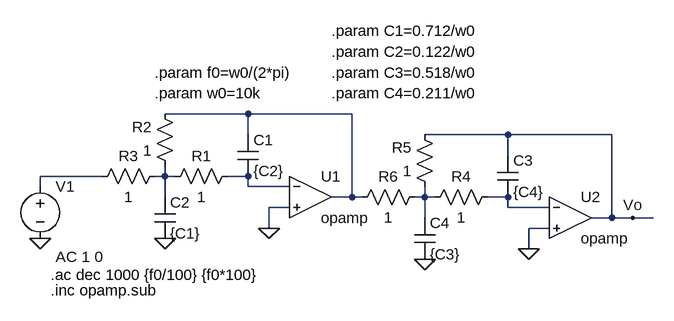
[diagram p0: schematic EJ6.asc]
EJ6.asc, the LTspice schematic file:
Version 4
SHEET 1 880 680
WIRE 112 48 -16 48
WIRE 272 48 112 48
WIRE 112 80 112 48
WIRE 512 80 384 80
WIRE 672 80 512 80
WIRE 512 112 512 80
WIRE -112 144 -208 144
WIRE -16 144 -16 128
WIRE -16 144 -32 144
WIRE 0 144 -16 144
WIRE 112 144 80 144
WIRE -208 160 -208 144
WIRE 112 160 112 144
WIRE 176 160 112 160
WIRE -16 176 -16 144
WIRE 272 176 272 48
WIRE 272 176 240 176
WIRE 288 176 272 176
WIRE 384 176 384 160
WIRE 384 176 368 176
WIRE 400 176 384 176
WIRE 512 176 480 176
WIRE 176 192 144 192
WIRE 512 192 512 176
WIRE 576 192 512 192
WIRE 384 208 384 176
WIRE 672 208 672 80
WIRE 672 208 640 208
WIRE 704 208 672 208
WIRE 736 208 704 208
WIRE 144 224 144 192
WIRE 576 224 544 224
WIRE 544 256 544 224
FLAG 144 224 0
FLAG -16 240 0
FLAG -208 240 0
FLAG 544 256 0
FLAG 384 272 0
FLAG 704 208 Vo
SYMBOL Opamps\\opamp 208 112 R0
SYMATTR InstName U1
SYMBOL cap 96 80 R0
SYMATTR InstName C1
SYMATTR Value {C2}
SYMBOL res 96 128 R90
WINDOW 0 0 56 VBottom 2
WINDOW 3 32 56 VTop 2
SYMATTR InstName R1
SYMATTR Value 1
SYMBOL res 0 144 R180
WINDOW 0 36 76 Left 2
WINDOW 3 36 40 Left 2
SYMATTR InstName R2
SYMATTR Value 1
SYMBOL res -128 160 R270
WINDOW 0 32 56 VTop 2
WINDOW 3 0 56 VBottom 2
SYMATTR InstName R3
SYMATTR Value 1
SYMBOL cap -32 176 R0
SYMATTR InstName C2
SYMATTR Value {C1}
SYMBOL voltage -208 144 R0
WINDOW 123 24 124 Left 2
WINDOW 39 0 0 Left 0
SYMATTR Value2 AC 1 0
SYMATTR InstName V1
SYMATTR Value ""
SYMBOL Opamps\\opamp 608 144 R0
SYMATTR InstName U2
SYMBOL cap 496 112 R0
SYMATTR InstName C3
SYMATTR Value {C4}
SYMBOL res 496 160 R90
WINDOW 0 0 56 VBottom 2
WINDOW 3 32 56 VTop 2
SYMATTR InstName R4
SYMATTR Value 1
SYMBOL res 400 176 R180
WINDOW 0 36 76 Left 2
WINDOW 3 36 40 Left 2
SYMATTR InstName R5
SYMATTR Value 1
SYMBOL res 272 192 R270
WINDOW 0 32 56 VTop 2
WINDOW 3 0 56 VBottom 2
SYMATTR InstName R6
SYMATTR Value 1
SYMBOL cap 368 208 R0
SYMATTR InstName C4
SYMATTR Value {C3}
TEXT -192 320 Left 2 !.inc opamp.sub
TEXT -192 296 Left 2 !.ac dec 1000 {f0/100} {f0*100}
TEXT 240 -80 Left 2 !.param C1=0.712/w0
TEXT 240 -48 Left 2 !.param C2=0.122/w0
TEXT 240 -16 Left 2 !.param C3=0.518/w0
TEXT 240 16 Left 2 !.param C4=0.211/w0
TEXT -32 16 Left 2 !.param w0=10k
TEXT -32 -16 Left 2 !.param f0=w0/(2*pi)

The netlist it stands for:
* EJ6.asc
XU1 N004 0 N001 opamp Aol=100K GBW=10Meg  ; pins invin noninvin out
C1 N001 N004 {C2}
R1 N004 N003 1
R2 N003 N001 1
R3 N002 N003 1
C2 N003 0 {C1}
V1 N002 0 AC 1 0
XU2 N006 0 Vo opamp Aol=100K GBW=10Meg  ; pins invin noninvin out
C3 Vo N006 {C4}
R4 N006 N005 1
R5 N005 Vo 1
R6 N001 N005 1
C4 N005 0 {C3}
.inc opamp.sub
.ac dec 1000 {f0/100} {f0*100}
.param C1=0.712/w0
.param C2=0.122/w0
.param C3=0.518/w0
.param C4=0.211/w0
.param w0=10k
.param f0=w0/(2*pi)
.backanno
.end